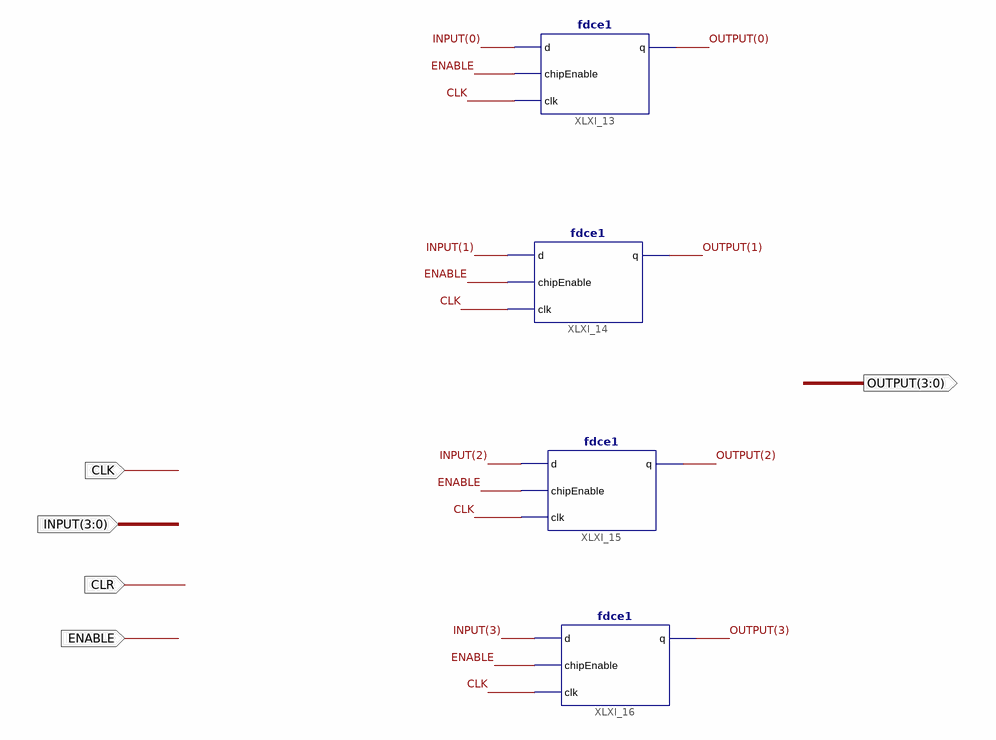
[diagram p0: schematic sheet 1]
// Xilinx ISE schematic LATCH4.sch (artix7) as structural Verilog: 4 symbols, 5 ports
module LATCH4 (
  input  CLK,
  input  [3:0] INPUT,
  input  CLR,
  input  ENABLE,
  output [3:0] OUTPUT
);

  fdce1 XLXI_13 (.clk(CLK), .chipEnable(ENABLE), .d(INPUT[0]), .q(OUTPUT[0]));
  fdce1 XLXI_14 (.clk(CLK), .chipEnable(ENABLE), .d(INPUT[1]), .q(OUTPUT[1]));
  fdce1 XLXI_15 (.clk(CLK), .chipEnable(ENABLE), .d(INPUT[2]), .q(OUTPUT[2]));
  fdce1 XLXI_16 (.clk(CLK), .chipEnable(ENABLE), .d(INPUT[3]), .q(OUTPUT[3]));
endmodule
